# EAGLE design CAN_ISO_Sensor_unit (EAGLE 9.6.2)
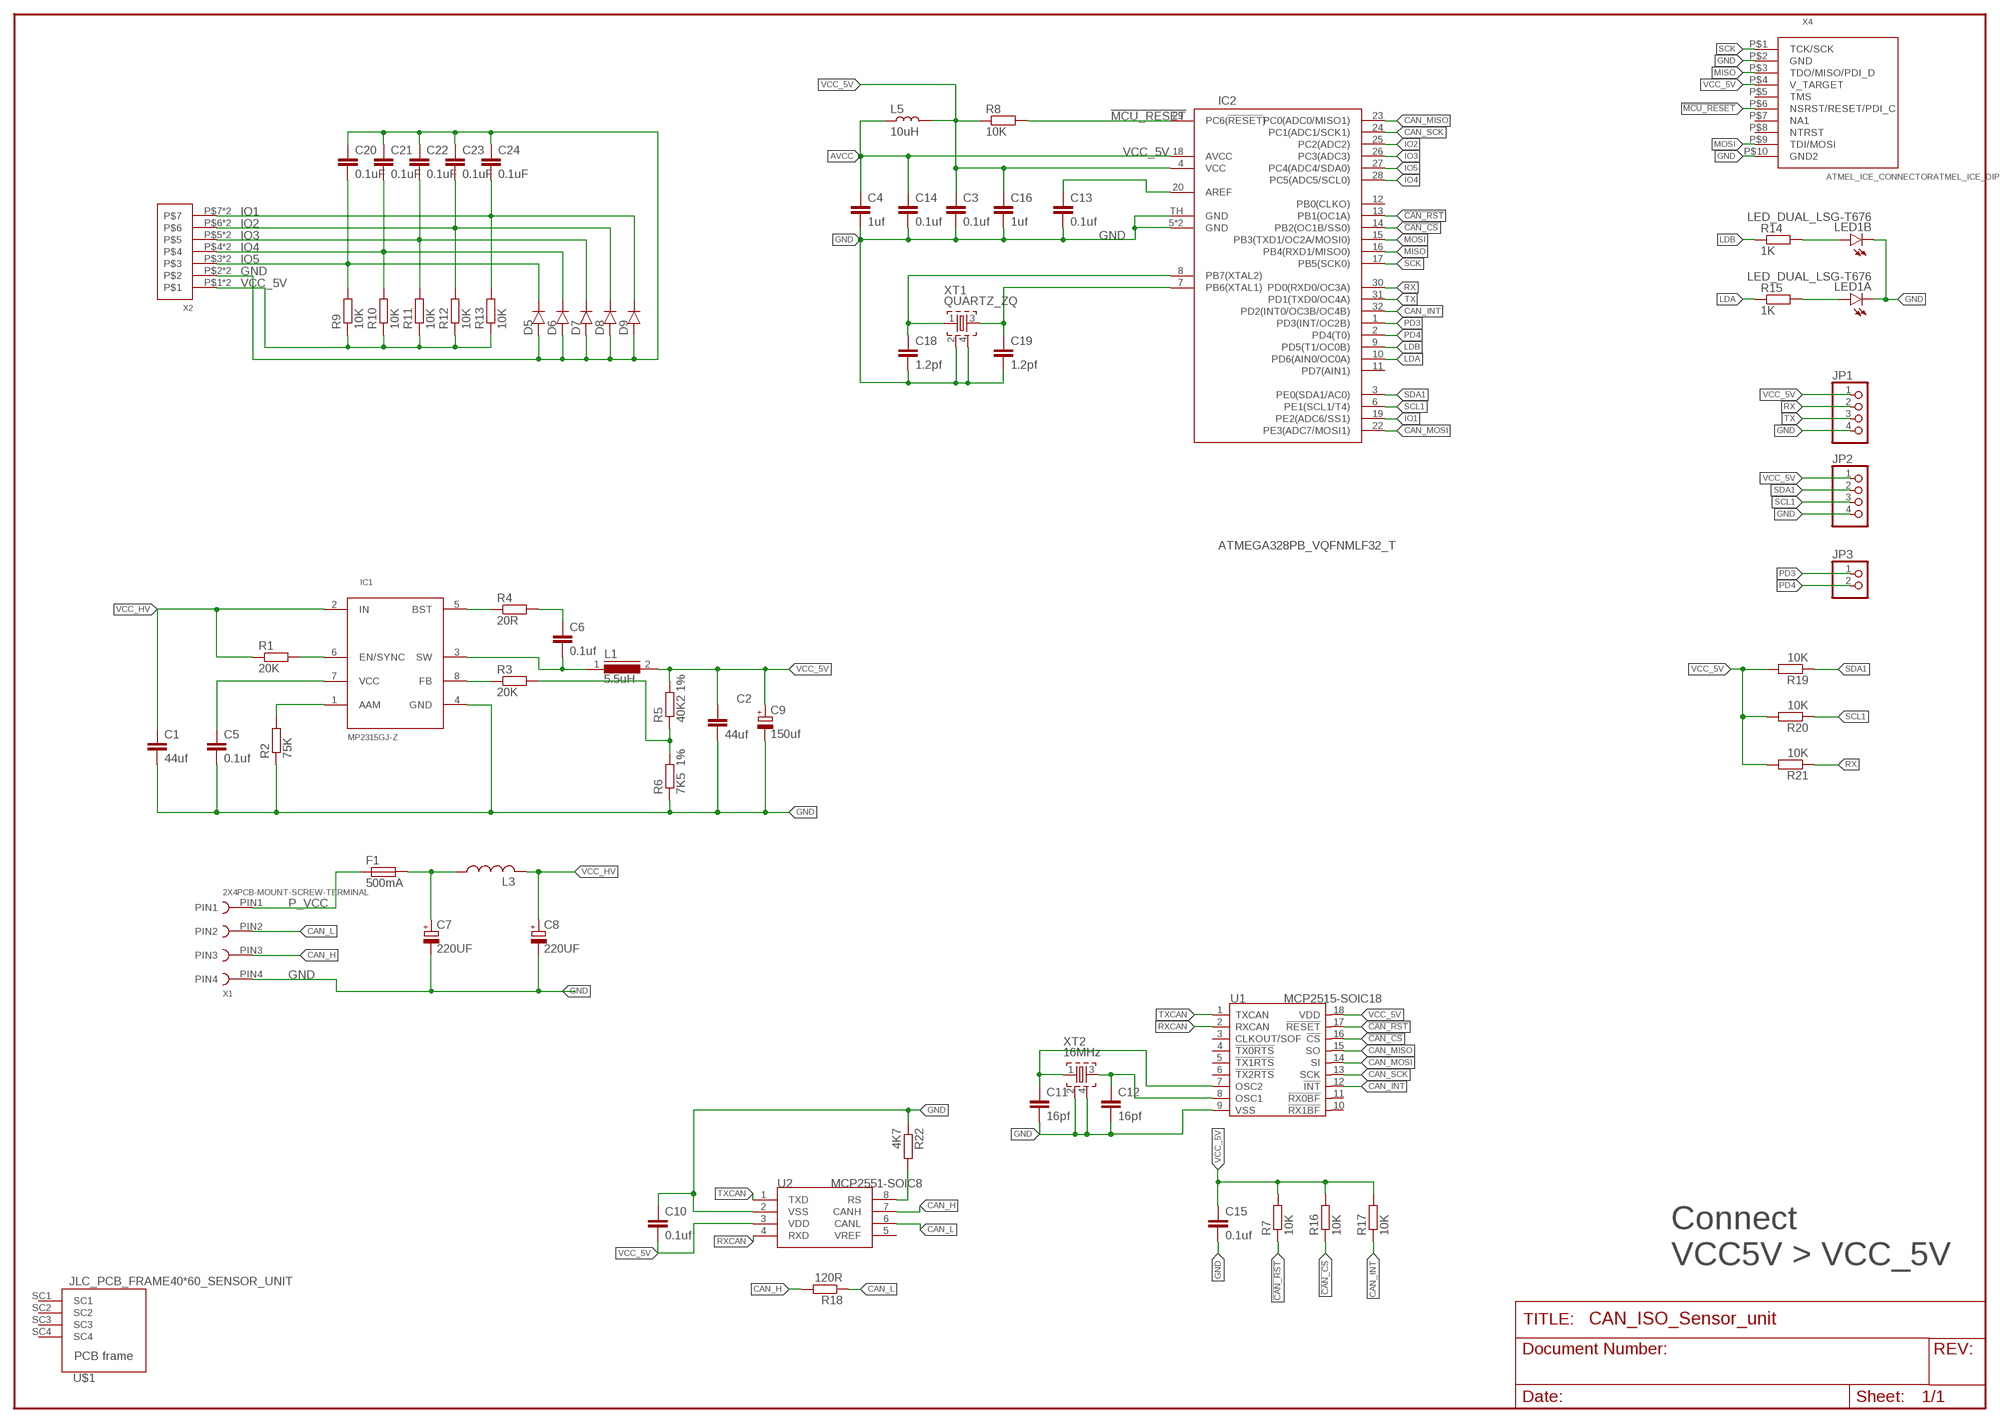
[diagram p0: schematic, sheet 1]

## Parts
C1  44uf  SMD_C3528  [3528_NP]
C2  44uf  SMD_C3528  [3528_NP]
C3  0.1uf  SMD_C0603  [0603]
C4  1uf  SMD_C0603  [0603]
C5  0.1uf  SMD_C0603  [0603]
C6  0.1uf  SMD_C0603  [0603]
C7  220UF  RADIAL_330UF_25V_8MM  [3.6MM]
C8  220UF  RADIAL_330UF_25V_8MM  [3.6MM]
C9  150uf  TANTAL_686_7343  [D/7343-31R]
C10  0.1uf  SMD_C0603  [0603]
C11  16pf  SMD_C0603  [0603]
C12  16pf  SMD_C0603  [0603]
C13  0.1uf  SMD_C0603  [0603]
C14  0.1uf  SMD_C0603  [0603]
C15  0.1uf  SMD_C0603  [0603]
C16  1uf  SMD_C0603  [0603]
C18  1.2pf  SMD_C0603  [0603]
C19  1.2pf  SMD_C0603  [0603]
C20  0.1uF  SMD_C0603  [0603]
C21  0.1uF  SMD_C0603  [0603]
C22  0.1uF  SMD_C0603  [0603]
C23  0.1uF  SMD_C0603  [0603]
C24  0.1uF  SMD_C0603  [0603]
D5  L1N4148WT1GSOD123_GALILE0_SMALL  [SOD-123_MINI-SMA]
D6  L1N4148WT1GSOD123_GALILE0_SMALL  [SOD-123_MINI-SMA]
D7  L1N4148WT1GSOD123_GALILE0_SMALL  [SOD-123_MINI-SMA]
D8  L1N4148WT1GSOD123_GALILE0_SMALL  [SOD-123_MINI-SMA]
D9  L1N4148WT1GSOD123_GALILE0_SMALL  [SOD-123_MINI-SMA]
F1  500mA  SMD_FUSE  [SMD_2410_FUSE_NOK]
IC1  MP2315GJ-Z  [TSOT23-8]
IC2  ATMEGA328PB_VQFNMLF32_T  [MLF32-TH]
JP1  PINHD-1X4  [1X04]
JP2  PINHD-1X4  [1X04]
JP3  PINHD-1X2  [1X02]
L1  5.5uH  DR73  [DR73]
L3  L-US0207/2V  [0207/2V]
L5  10uH  SMD_L  [0805]
LED1  LED_DUAL_LSG-T676  [P-LCC4-0]
R1  20K  SMD_R0603  [0603]
R2  75K  SMD_R0603  [0603]
R3  20K  SMD_R0603  [0603]
R4  20R  SMD_R0603  [0603]
R5  40K2 1%  SMD_R0603  [0603]
R6  7K5 1%  SMD_R0603  [0603]
R7  10K  SMD_R0603  [0603]
R8  10K  SMD_R0603  [0603]
R9  10K  SMD_R0603  [0603]
R10  10K  SMD_R0603  [0603]
R11  10K  SMD_R0603  [0603]
R12  10K  SMD_R0603  [0603]
R13  10K  SMD_R0603  [0603]
R14  1K  SMD_R0603  [0603]
R15  1K  SMD_R0603  [0603]
R16  10K  SMD_R0603  [0603]
R17  10K  SMD_R0603  [0603]
R18  120R  SMD_R0603  [0603]
R19  10K  SMD_R0603  [0603]
R20  10K  SMD_R0603  [0603]
R21  10K  SMD_R0603  [0603]
R22  4K7  SMD_R0603  [0603]
U1  MCP2515-SOIC18  [SO18L]
U2  MCP2551-SOIC8  [SO8]
U$1  JLC_PCB_FRAME40*60_SENSOR_UNIT  [40X60_SENSOR_UNIT]
X1  2X4PCB-MOUNT-SCREW-TERMINAL  [2X4PCB-MOUNT-SCREW-TERMINAL]
X2  WAGO250_X7  [WAGO250_FP_7X]
X4  ATMEL_ICE_CONNECTORATMEL_ICE_DIP_V  [MINI10P_SPI/JTAG/PDI_DIP_V]
XT1  QUARTZ_ZQ  [QUARTZ_3X3MM]
XT2  16MHz  QUARTZ_ZQ  [QUARTZ_3X3MM]

## Nets
!CAN_CS: IC2.14(PB2(OC1B/SS0)) R16.1 U1.16(!CS)
!CAN_RST: IC2.13(PB1(OC1A)) R7.1 U1.17(!RESET)
!MCU_RESET: IC2.29(PC6(!RESET!)) R8.2 X4.P$6(NSRST/RESET/PDI_C)
AREF: C13.1 IC2.20(AREF)
AVCC: C4.1 C14.1 IC2.18(AVCC) L5.1
CAN_H: R18.2 U2.7(CANH) X1.PIN3
CAN_INT: IC2.32(PD2(INT0/OC3B/OC4B)) R17.1 U1.12(!INT)
CAN_L: R18.1 U2.6(CANL) X1.PIN2
CAN_MISO: IC2.23(PC0(ADC0/MISO1)) U1.15(SO)
CAN_MOSI: IC2.22(PE3(ADC7/MOSI1)) U1.14(SI)
CAN_SCK: IC2.24(PC1(ADC1/SCK1)) U1.13(SCK)
FB: R3.2 R5.1 R6.2
GND: C1.P C2.P C3.2 C4.2 C5.2 C7.P$1(-) C8.P$1(-) C9.- C10.1 C11.2 C12.2 C13.2 C14.2 C15.2 C16.2 C18.2 C19.2 C20.1 C21.1 C22.1 C23.1 C24.1 D5.A D6.A D7.A D8.A D9.A IC1.4(GND) IC2.5(GND) IC2.21(GND) IC2.TH(GND) JP1.4 JP2.4 LED1.1(A:C) LED1.3(B:C) R2.1 R6.1 R22.1 U1.9(VSS) U2.2(VSS) X1.PIN4 X2.P$2 X2.U$2 X4.P$2(GND) X4.P$10(GND2) XT1.2 XT1.4 XT2.2 XT2.4
IO1: C24.2 D9.C IC2.19(PE2(ADC6/SS1)) R13.2 X2.P$7 X2.U$7
IO2: C23.2 D8.C IC2.25(PC2(ADC2)) R12.2 X2.P$6 X2.U$6
IO3: C22.2 D7.C IC2.26(PC3(ADC3)) R11.2 X2.P$5 X2.U$5
IO4: C21.2 D6.C IC2.28(PC5(ADC5/SCL0)) R10.2 X2.P$4 X2.U$4
IO5: C20.2 D5.C IC2.27(PC4(ADC4/SDA0)) R9.2 X2.P$3 X2.U$3
LDA: IC2.10(PD6(AIN0/OC0A)) R15.1
LDB: IC2.9(PD5(T1/OC0B)) R14.1
MISO: IC2.16(PB4(RXD1/MISO0)) X4.P$3(TDO/MISO/PDI_D)
MOSI: IC2.15(PB3(TXD1/OC2A/MOSI0)) X4.P$9(TDI/MOSI)
N$1: C7.P$2(+) F1.P$2 L3.1
N$2: IC1.1(AAM) R2.2
N$3: LED1.4(B:A) R14.2
N$4: LED1.2(A:A) R15.2
N$5: C5.1 IC1.7(VCC)
N$6: IC1.6(EN/SYNC) R1.2
N$7: C12.1 U1.8(OSC1) XT2.3
N$8: C11.1 U1.7(OSC2) XT2.1
N$9: IC1.5(BST) R4.1
N$10: C6.1 R4.2
N$11: C6.2 IC1.3(SW) L1.1
N$12: IC1.8(FB) R3.1
N$13: R22.2 U2.8(RS)
N$18: C18.1 IC2.8(PB7(XTAL2)) XT1.1
N$19: C19.1 IC2.7(PB6(XTAL1)) XT1.3
P_VCC: F1.P$1 X1.PIN1
PD3: IC2.1(PD3(INT/OC2B)) JP3.1
PD4: IC2.2(PD4(T0)) JP3.2
RX: IC2.30(PD0(RXD0/OC3A)) JP1.2 R21.1
RXCAN: U1.2(RXCAN) U2.4(RXD)
SCK: IC2.17(PB5(SCK0)) X4.P$1(TCK/SCK)
SCL1: IC2.6(PE1(SCL1/T4)) JP2.3 R20.1
SDA1: IC2.3(PE0(SDA1/AC0)) JP2.2 R19.1
TX: IC2.31(PD1(TXD0/OC4A)) JP1.3
TXCAN: U1.1(TXCAN) U2.1(TXD)
VCC_5V: C2.M C3.1 C9.+ C10.2 C15.1 C16.1 IC2.4(VCC) JP1.1 JP2.1 L1.2 L5.2 R5.2 R7.2 R8.1 R9.1 R10.1 R11.1 R12.1 R13.1 R16.2 R17.2 R19.2 R20.2 R21.2 U1.18(VDD) U2.3(VDD) X2.P$1 X2.U$1 X4.P$4(V_TARGET)
VCC_HV: C1.M C8.P$2(+) IC1.2(IN) L3.2 R1.1
Unconnected: IC2.11(PD7(AIN1)) IC2.12(PB0(CLKO)) U1.3(CLKOUT/SOF) U1.4(!TX0RTS) U1.5(!TX1RTS) U1.6(!TX2RTS) U1.10(!RX1BF) U1.11(!RX0BF) U2.5(VREF) U$1.SC1 U$1.SC2 U$1.SC3 U$1.SC4 X4.P$5(TMS) X4.P$7(NA1) X4.P$8(NTRST)

## Notes on the sheet
- Connect 
  VCC5V > VCC_5V

## Library data of the parts
C1-C6 C10-C16 C18-C24 = passive_components:SMD_C
C7 C8 = passive_components:RADIAL_330UF_25V_8MM
C9 = passive_components:TANTAL_686_7343
D5-D9 = passive_components:L1N4148WT1G
F1 = passive_components:SMD_FUSE
IC1 = my_IC:MP2315GJ-Z
IC2 = my_IC:ATMEGA328PB_VQFN
JP1 JP2 = pinhead:PINHD-1X4: PIN HEADER
JP3 = pinhead:PINHD-1X2: PIN HEADER
L1 = inductors:DR73: High Power Density, High Efficiency, Shielded Inductors Source: coiltronics_dr_series.pdf
L3 = rcl:L-US: INDUCTOR, American symbol
L5 = passive_components:SMD_L
LED1 = passive_components:LED_DUAL_LSG-T676: LSG T676 Hyper Multi TOPLED ® Hyper-Bright LED Source: http://docs-europe.electrocomponents.com/webdocs/08c3/0900766b808c36ca.pdf
R1-R22 = passive_components:SMD_R
U1 = my_IC:MCP2515: Stand-Alone CAN Controller With SPI Interface
U2 = my_IC:MCP2551: High-Speed CAN Transceiver http://ww1.microchip.com/downloads/en/devicedoc/21667f.pdf
U$1 = passive_components:JLC_PCB_FRAME
X1 = Wago_250:2X4PCB-MOUNT-SCREW-TERMINAL
X2 = Wago_250:WAGO250_X7
X4 = passive_components:ATMEL_ICE_CONNECTOR
XT1 XT2 = passive_components:QUARTZ_ZQ

## Board
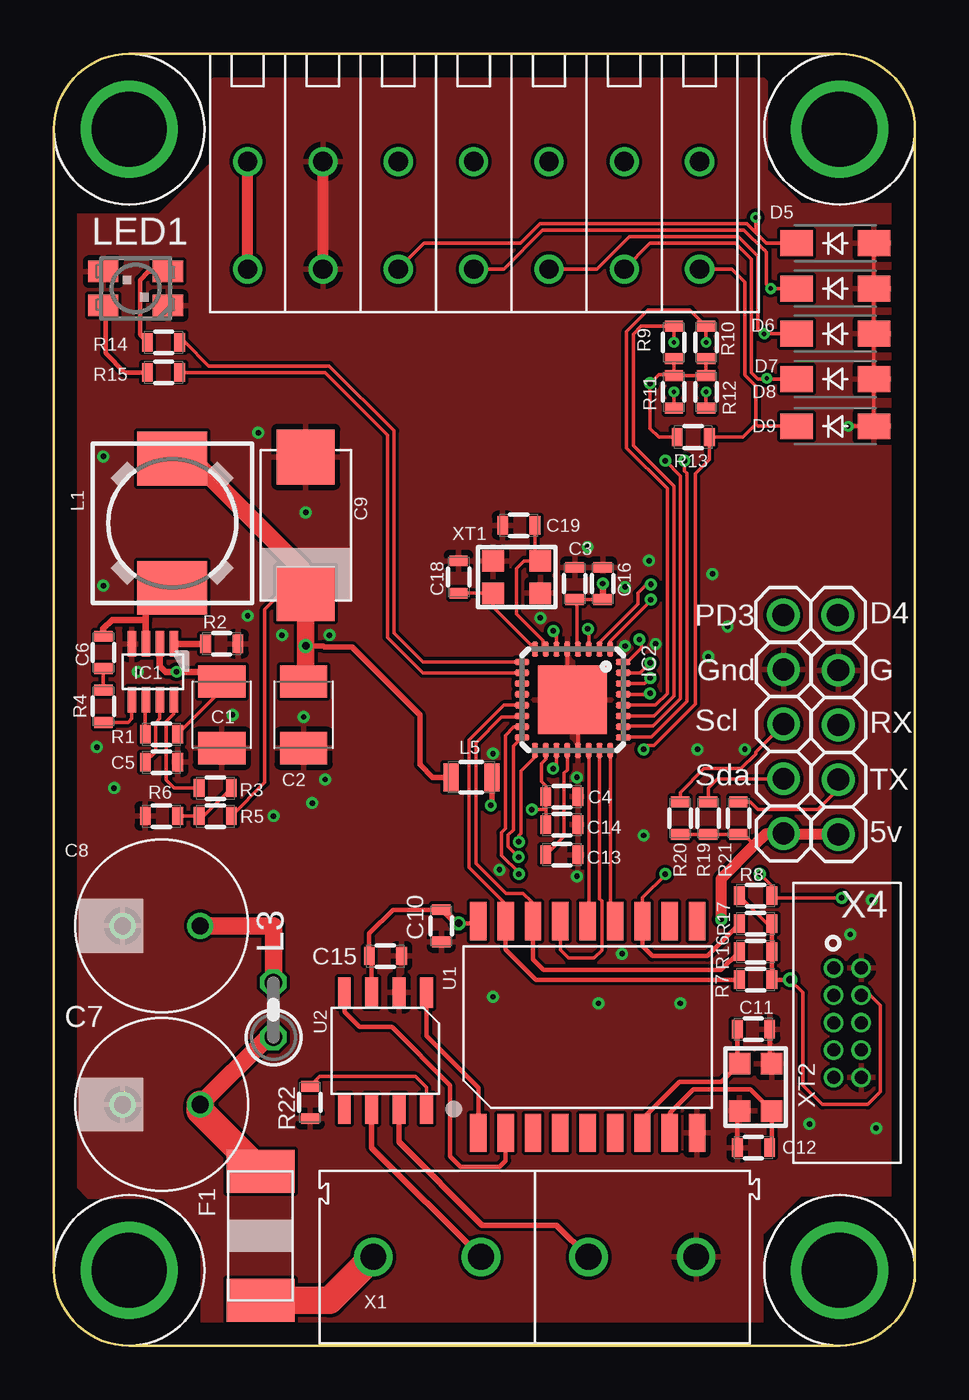
[diagram p1: board, top side]
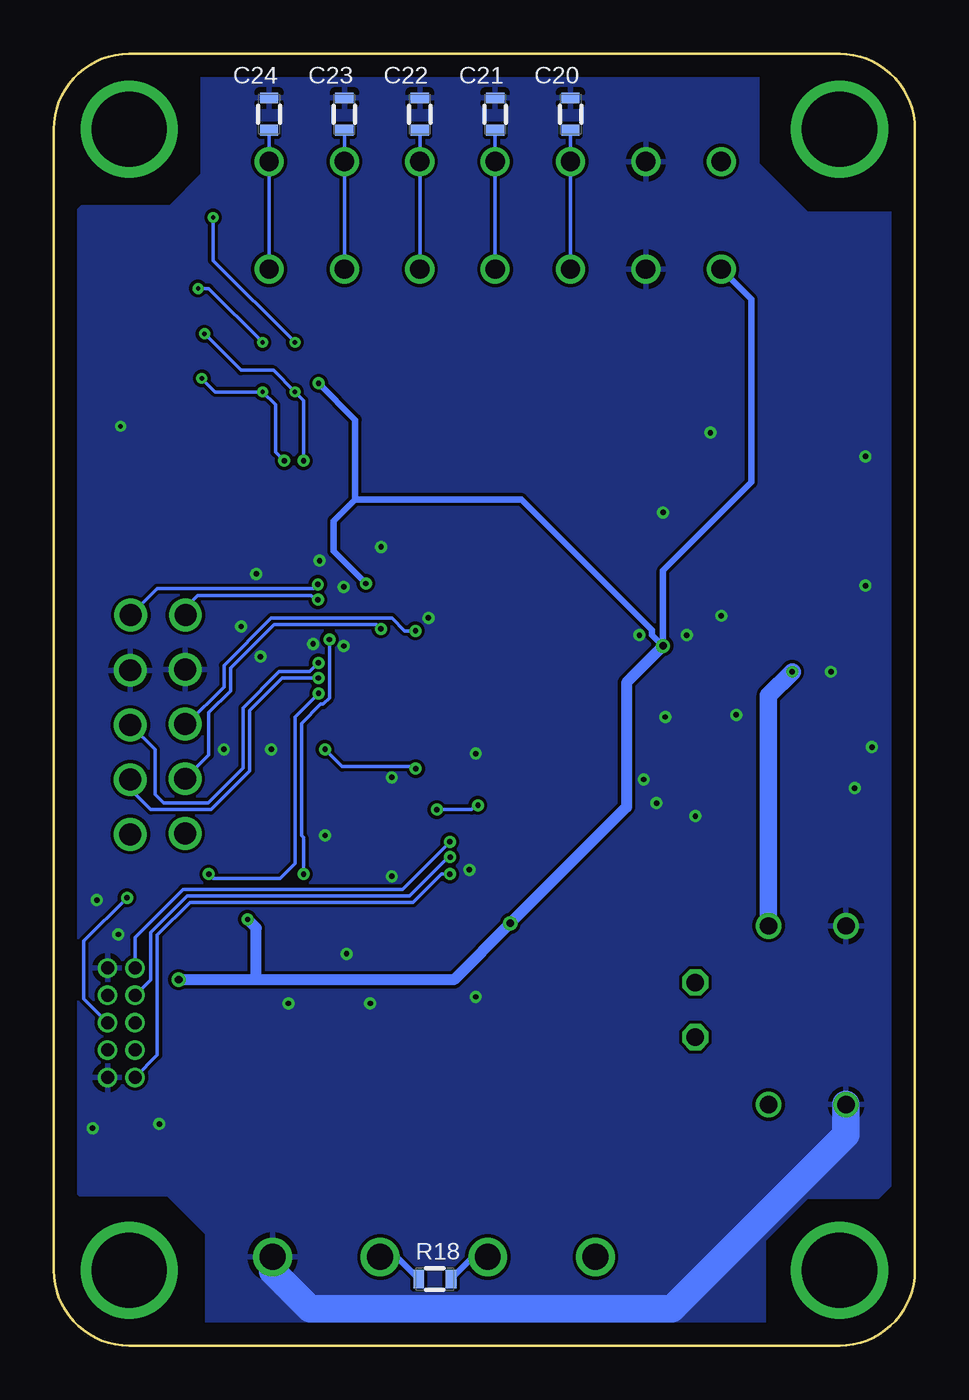
[diagram p2: board, bottom side, seen from below]

Size 40 x 60 mm. Coordinates in mm from the lower left corner, seen from the top.
Copper layers (1*16): Top 0.035mm / dielectric 1.5mm / Bottom 0.035mm
Design rules "default *": minimum track width 6mil, minimum drill 0.2mm, track to track 6mil, track to pad 6mil, pad to pad 6mil, via to via 6mil, smd to smd 6mil, copper to edge 40mil, drill to drill 6mil, minimum pad ring 6mil, minimum via ring 6mil, stop-mask expansion 4mil, vias tented up to drill 20mil, thermal gap 10mil

### Footprints (pad centres in the part's own frame; a part is rotated, then mirrored left to right if it is on the bottom)
3528_NP = smd 1.5 x 2.2: M -1.55,0; P 1.55,0
0603 = smd 0.85 x 0.5: 1 0,0.75; 2 0,-0.75
3.6MM = drill 0.8: P$1 -1.8,0; P$2 1.8,0
D/7343-31R = smd 2.55 x 2.7: + 3.175,0; - -3.175,0
SOD-123_MINI-SMA = smd 1.5 x 1.2: A 1.8,0; C -1.8,0
SMD_2410_FUSE_NOK = smd 2 x 3.15: P$1 -3,0; P$2 3,0
TSOT23-8 = smd 1.2 x 0.4: 1 -1.3,0.975; 2 -1.3,0.325; 3 -1.3,-0.325; 4 -1.3,-0.975; 5 1.3,-0.975; 6 1.3,-0.325; 7 1.3,0.325; 8 1.3,0.975
MLF32-TH = smd 0.7 x 0.3: 1 -2.35,1.75; 2 -2.35,1.25; 3 -2.35,0.75; 4 -2.35,0.25; 5 -2.35,-0.25; 6 -2.35,-0.75; 7 -2.35,-1.25; 8 -2.35,-1.75; 17 2.35,-1.75; 18 2.35,-1.25; 19 2.35,-0.75; 20 2.35,-0.25; 21 2.35,0.25; 22 2.35,0.75; 23 2.35,1.25; 24 2.35,1.75 | smd 0.3 x 0.7: 9 -1.75,-2.35; 10 -1.25,-2.35; 11 -0.75,-2.35; 12 -0.25,-2.35; 13 0.25,-2.35; 14 0.75,-2.35; 15 1.25,-2.35; 16 1.75,-2.35; 25 1.75,2.35; 26 1.25,2.35; 27 0.75,2.35; 28 0.25,2.35; 29 -0.25,2.35; 30 -0.75,2.35; 31 -1.25,2.35; 32 -1.75,2.35 | smd 3.2 x 3.2: TH 0,0
1X04 = drill 1.016: 1 -3.81,0; 2 -1.27,0; 3 1.27,0; 4 3.81,0
1X02 = drill 1.016: 1 -1.27,0; 2 1.27,0
DR73 = smd 2.5 x 3.25: 1 -3,0; 2 3,0
0207/2V = drill 0.813 octagon: 1 -1.27,0; 2 1.27,0
0805 = smd 1.3 x 0.7: 1 0,0.95; 2 0,-0.95
P-LCC4-0 = smd 1 x 1.4: 1 -0.787,-1.5; 2 -0.787,1.5; 3 0.787,1.5; 4 0.787,-1.5
SO18L = smd 0.762 x 1.778: 1 -5.08,-4.915; 2 -3.81,-4.915; 3 -2.54,-4.915; 4 -1.27,-4.915; 5 0,-4.915; 6 1.27,-4.915; 7 2.54,-4.915; 8 3.81,-4.915; 9 5.08,-4.915; 10 5.08,4.915; 11 3.81,4.915; 12 2.54,4.915; 13 1.27,4.915; 14 0,4.915; 15 -1.27,4.915; 16 -2.54,4.915; 17 -3.81,4.915; 18 -5.08,4.915
SO8 = smd 0.6 x 1.4: 1 -1.905,-2.7; 2 -0.635,-2.7; 3 0.635,-2.7; 4 1.905,-2.7; 5 1.905,2.7; 6 0.635,2.7; 7 -0.635,2.7; 8 -1.905,2.7
40X60_SENSOR_UNIT = drill 3.5: SC1 3.5,56.5; SC2 36.5,56.5; SC3 3.5,3.5; SC4 36.5,3.5
2X4PCB-MOUNT-SCREW-TERMINAL = drill 1.2: PIN1 0,2.5; PIN2 0,-2.5; PIN3 0,-7.5; PIN4 0,-12.5
WAGO250_FP_7X = drill 0.9: P$1 0,5; P$2 3.5,5; P$3 7,5; P$4 10.5,5; P$5 14,5; P$6 17.5,5; P$7 21,5; U$1 0,0; U$2 3.5,0; U$3 7,0; U$4 10.5,0; U$5 14,0; U$6 17.5,0; U$7 21,0
MINI10P_SPI/JTAG/PDI_DIP_V = drill 0.6: P$1 -2.54,-1.27; P$2 -2.54,0; P$3 -1.27,-1.27; P$4 -1.27,0; P$5 0,-1.27; P$6 0,0; P$7 1.27,-1.27; P$8 1.27,0; P$9 2.54,-1.27; P$10 2.54,0
QUARTZ_3X3MM = smd 1 x 1: 1 -0.75,1.1; 2 0.75,1.1; 3 0.75,-1.1; 4 -0.75,-1.1

### Placement (x,y rotation side)
C1  7.8,29.3 270 top
C2  11.6,29.3 270 top
C3  24.2,35.4 180 top
C4  23.6,25.5 90 top
C5  5,27.1 90 top
C6  2.3,32.2 180 top
C7  5,11.2 0 top
C8  5,19.5 0 top
C9  11.7,38.1 270 top
C10  18,19.5 180 top
C11  32.5,14.7 90 top
C12  32.5,9.2 270 top
C13  23.6,22.8 90 top
C14  23.6,24.2 90 top
C15  15.4,18.1 90 top
C16  25.5,35.4 180 top
C18  18.8,35.7 180 top
C19  21.6,38.1 270 top
C20  16,57.2 0 bottom
C21  19.5,57.2 0 bottom
C22  23,57.2 0 bottom
C23  26.5,57.2 0 bottom
C24  30,57.2 0 bottom
D5  36.3,51.2 0 top
D6  36.3,49.1 0 top
D7  36.3,47 0 top
D8  36.3,44.9 0 top
D9  36.3,42.7 0 top
F1  9.6,5.1 90 top
IC1  4.6,31.3 270 top
IC2  24.1,30 270 top
JP1  36.45,27.56 90 top
JP2  33.9,27.6 90 top
JP3  35.15,33.93 0 top
L1  5.5,38.2 90 top
L3  10.2,15.6 90 top
L5  19.4,26.4 270 top
LED1  3.8,49.1 90 top
R1  5,28.4 270 top
R2  7.8,32.6 270 top
R3  7.5,25.9 90 top
R4  2.3,29.7 180 top
R5  7.5,24.6 90 top
R6  5,24.6 90 top
R7  32.6,17 90 top
R8  32.6,20.9 90 top
R9  28.8,46.6 180 top
R10  30.3,46.6 180 top
R11  28.8,44.3 0 top
R12  30.3,44.3 0 top
R13  29.7,42.2 90 top
R14  5.1,46.6 270 top
R15  5.1,45.2 270 top
R16  32.6,18.3 90 top
R17  32.6,19.6 90 top
R18  22.3,3.1 270 bottom
R19  30.4,24.5 0 top
R20  29.1,24.5 0 top
R21  31.8,24.5 0 top
R22  11.9,11.3 180 top
U1  24.8,14.8 0 top
U2  15.4,13.7 180 top
U$1  0,0 0 top
X1  17.34,4.12 90 top
X2  9,50 0 top
X4  37.5,15 270 top
XT1  21.5,35.7 90 top
XT2  32.6,12 0 top

### Tracks (layer width: path | path; a pad name or v marks a point on that pad's centre or on a via)
!CAN_CS
  Top 0.152: U1.16 22.2,19.77 22.2,20.6 21.8,21 21,21 19.6,22.4 19.6,28 20.8,29.2 21.7,29.2 IC2.14
  Top 0.2: R16.1 31,17.45 22.75,17.45 22.26,17.94 U1.16
!CAN_RST
  Top 0.152: U1.17 20.99,20.51 19.3,22.2 19.3,28.13 20.92,29.75 IC2.13
  Top 0.2: R7.1 22.4,17 20.99,18.41 U1.17
!MCU_RESET  (via drill 0.25 pad 0.55)
  Top 0.152: v36.6,20.8 33.45,20.8 R8.2 33.35,21.35 v32.8,21.9 | v27.7,30.3 27.65,30.25 IC2.29
  Bottom 0.152: X4.P$6 38.6,16.1 38.6,18.8 v36.6,20.8 | v32.8,21.9 32.6,21.7 29.5,21.7 28.8,22.4 28.8,29.2 v27.7,30.3
AREF
  Top 0.152: IC2.20 23.85,26.75 23.7,26.6 23.7,23.65 C13.1
AVCC  (via drill 0.25 pad 0.55)
  Top 0.152: IC2.18 22.85,27.25 22.65,27.05 22.65,26.2 22.85,26 C4.1 22.85,24.9 | 22.85,24.9 C14.1 | v22.2,24.9 22.85,24.9
  Top 0.254: v20.3,25.1 20.35,25.15 L5.1
  Bottom 0.152: v20.3,25.1 20.4,25.1 20.6,24.9 v22.2,24.9
CAN_H
  Top 0.254: X1.PIN3 23.36,5.6 19.9,5.6 16.04,9.46 U2.7
  Bottom 0.254: R18.2 24.07,4.12 X1.PIN3
CAN_INT  (via drill 0.25 pad 0.55)
  Top 0.152: IC2.32 26.65,31.75 27.3,32.4 27.3,32.7 v27.2,32.8 | v28.4,21.9 28.4,21.88 27.34,20.82 U1.12
  Top 0.2: R17.1 30.35,18.1 27.8,18.1 27.34,18.56 U1.12
  Bottom 0.152: v27.2,32.8 27.2,30.52 27.19,30.51 27.19,30.09 27.49,29.79 27.61,29.79 28.5,28.91 28.5,23.7 28.4,23.6 v28.4,21.9
CAN_L
  Top 0.254: X1.PIN2 14.77,9.2 U2.6
  Bottom 0.254: R18.1 20.53,4.12 X1.PIN2
CAN_MISO
  Top 0.152: IC2.23 25.35,20.76 25.46,20.65 25.46,18.36 25.1,18 23.9,18 23.53,18.37 U1.15
CAN_MOSI
  Top 0.152: IC2.22 24.85,19.77 U1.14
CAN_SCK
  Top 0.152: IC2.24 25.85,19.93 U1.13
FB
  Top 0.152: R3.2 6.95,24.6 R5.1 R6.2
GND  (via drill 0.2 pad 0.35, 0.25)
  Top 0.152: D5.A D6.A D7.A D8.A D9.A v36.9,42.7 | IC2.21 24.35,29.75 24.25,29.85 | 24.25,29.85 IC2.TH | IC2.5 23.85,31.25 24.25,30.85 24.25,29.85
  Top 0.2: C11.2 33.25,13.2 XT2.2 | C12.2 31.75,10.8 XT2.4
  Top 0.508: X2.U$2 X2.P$2
  Bottom 1.27: X1.PIN4 29.84,3.45 28.1,1.71 11.29,1.71 3.2,9.8 C7.P$1
  other vias: 2.3,35.3 3.9,31.3 2,27.8 2.8,25.9 8.3,29.3 11.6,29.2 12.6,26.3 12,25.2 10.2,24.6 10.6,33 9,33.9 12.8,33 11.7,38.7 2.3,41.3 9.5,42.4 24.3,26.4 24.3,21.8 22.6,33.8 24.8,37.1 37,19.1 38,20.7 35.1,10.3 38.2,10.1 20.4,27.5 20.7,22.1 30.4,32 32.1,27.7 31.3,33.4 29.9,27.7 27.4,23.7 26.4,18.2 20.4,16.2 29.1,15.9 25.3,15.9 27.96,32.6 26.54,35.24 26.54,32.5 30.6,35.85 27.65,36.46
  pour Bottom: 0.4,52.6 5,52.6 7.3,54.9 7.3,59.1 8,59.8 32.5,59.8 33.1,59.2 33.1,54.4 34.6,52.9 38.7,52.9 39.8,51.8 39.8,8 38.8,7 34.7,7 32.9,5.2 32.9,0.6 32.3,0 8.1,0 7,1.1 7,4.9 5,6.9 1.7,6.9 0.3,8.3 0.3,52.5
  pour Top: 0.4,52.5 4.9,52.5 7.3,54.9 7.3,58.7 8,59.4 32.4,59.4 33.1,58.7 33.1,54.6 34.6,53.1 34.7,53 38.2,53 39.2,53 39.7,52.5 39.7,7.4 39.3,7 34.8,7 34.7,7 33,5.3 32.9,5.2 32.9,1.7 32.9,1.1 32.1,0.3 31.6,0.3 7.4,0.3 7,0.7 6.9,0.8 6.9,4.1 6.9,5.1 5.1,6.9 1.9,6.9 1.6,6.9 1.1,7.4 1.1,7.5 0.3,8.3 0.3,52.4
IO1  (via drill 0.25 pad 0.55)
  Top 0.152: X2.U$7 31.49,50 32.09,49.4 32.09,45.08 32.6,44.57 32.6,42.8 | 32.6,42.8 32.7,42.7 D9.C | 32.6,42.8 32,42.2 R13.2 30.45,41.15 29.8,40.5 29.8,29.8 27.87,27.87 27.57,27.87 v27.4,27.7 | IC2.19 23.35,26.96 v23.19,26.8
  Bottom 0.152: X2.U$7 X2.P$7 C24.2 | v23.19,26.8 23.3,26.91 24.51,26.91 24.52,26.9 26.6,26.9 v27.4,27.7
IO2  (via drill 0.2 pad 0.35, 0.25 pad 0.55)
  Top 0.152: X2.U$6 27.7,51.2 31.67,51.2 32.4,50.47 32.4,47.07 32.4,45.2 32.7,44.9 33.1,44.9 | 33.1,44.9 D8.C | R12.2 v30.3,44.3 | v33.12,44.92 33.1,44.9 | IC2.25 26.47,28.27 27.77,28.27 29.41,29.92 29.41,40.52 29.3,40.63 v29.3,41.1
  Bottom 0.152: X2.U$6 X2.P$6 C23.2 | v33.12,44.92 32.5,44.3 v30.3,44.3 29.7,43.7 29.7,41.5 v29.3,41.1
IO3  (via drill 0.2 pad 0.35, 0.25 pad 0.55)
  Top 0.152: 22.98,50 X2.U$5 25.22,50 26.73,51.51 31.8,51.51 32.7,50.6 32.7,47.2 32.9,47 v33,47 D7.C | R11.2 v28.8,44.3 | IC2.26 26.47,28.77 27.83,28.77 29.11,30.05 29.11,40.39 v28.4,41.1
  Bottom 0.152: X2.U$5 X2.P$5 C22.2 | v33,47 31.3,45.3 29.8,45.3 v28.8,44.3 28.4,43.9 v28.4,41.1
IO4  (via drill 0.2 pad 0.35)
  Top 0.152: 19,50 X2.U$4 20.9,50 22.71,51.81 32.06,51.81 32.97,50.9 33,50.9 33.1,50.8 33.1,49.3 v33.3,49.1 D6.C | v30.3,46.6 R10.2 29.55,48.1 27.6,48.1 26.6,47.1 26.6,41.7 28.5,39.8 28.5,30.3 27.95,29.75 IC2.28
  Bottom 0.152: X2.U$4 X2.P$4 C21.2 | v30.3,46.6 32.8,49.1 v33.3,49.1
IO5  (via drill 0.2 pad 0.35)
  Top 0.152: X2.U$3 17.2,51.2 21.67,51.2 22.58,52.11 32.19,52.11 32.6,51.7 | D5.C 33.1,51.2 32.6,51.7 | v28.8,46.6 R9.2 27.28,47.35 26.92,46.98 26.92,41.82 28.8,39.93 28.8,30.17 27.88,29.25 IC2.27 | v32.6,52.4 32.6,51.7
  Bottom 0.152: X2.U$3 X2.P$3 C20.2 | v28.8,46.6 32.6,50.4 v32.6,52.4
LDA
  Top 0.152: R15.1 12.6,45.2 15.5,42.3 15.5,32.9 17.15,31.25 IC2.10
LDB
  Top 0.152: R14.1 6.1,46.6 7.2,45.51 12.79,45.51 15.8,42.49 15.8,33.09 17.15,31.75 IC2.9
MISO  (via drill 0.25 pad 0.55)
  Top 0.152: v21.59,22.69 21.09,23.19 21.09,23.71 21.35,23.96 21.35,27.85 IC2.16
  Bottom 0.152: v21.59,22.69 21.68,22.69 23.47,20.89 33.8,20.89 35.5,19.2 35.5,17 X4.P$3
MOSI  (via drill 0.25 pad 0.55)
  Top 0.152: IC2.15 21.73,28.73 21.35,28.73 20.97,28.35 20.97,24.02 20.79,23.84 20.79,22.78 21.6,21.97 v21.6,21.9
  Bottom 0.152: v21.6,21.9 22,21.9 23.31,20.59 33.68,20.59 35.2,19.07 35.2,13.49 X4.P$9
N$1
  Top 0.813: C7.P$2 9.93,14.33 L3.1
  Top 1.27: F1.P$2 6.8,10.9 C7.P$2
N$2
  Top 0.305: IC1.1 R2.2
N$3
  Top 0.2: LED1.4 4.39,49.89 4,49.5 4,46.95 R14.2
N$4
  Top 0.2: LED1.2 2.4,48.21 2.4,46.1 3.3,45.2 R15.2
N$5
  Top 0.152: IC1.7 4.92,29.12 4.73,28.93 4.73,27.58 C5.1
N$6
  Top 0.152: R1.2 4.25,29.98 IC1.6
N$7
  Top 0.2: C12.1 33.35,9.3 XT2.3 32.35,11.9 29.7,11.9 28.61,10.81 U1.8
N$8
  Top 0.2: C11.1 31.75,13.2 XT2.1 31,12.25 29.05,12.25 27.34,10.54 U1.7
N$9
  Top 0.152: R4.1 3.45,28.95 3.62,29.12 IC1.5
N$10
  Top 0.152: C6.1 R4.2
N$11
  Top 0.305: IC1.3 4.28,33.7 | 4.28,33.7 4.28,33.98 L1.1 | C6.2 2.3,33.3 2.7,33.7 4.28,33.7
N$12
  Top 0.152: IC1.8 5.58,29.34 5.22,28.98 5.22,26.28 5.6,25.9 R3.1
N$13
  Top 0.152: U2.8 17.3,11.99 16.8,12.5 12.35,12.5 R22.2
N$18
  Top 0.152: C18.1 XT1.1 20.4,34.3 IC2.8
N$19
  Top 0.152: IC2.7 22.73,32.47 22.73,32.75 21.5,33.98 21.5,36.1 21.85,36.45 XT1.3 22.35,36.7 C19.1
P_VCC
  Top 1.27: X1.PIN1 12.82,2.1 F1.P$1
PD3  (via drill 0.25 pad 0.55)
  Top 0.152: IC2.1 25.85,32.73 27.73,34.61 v27.73,34.65
  Bottom 0.152: v27.73,34.65 27.84,34.65 28.04,34.85 33.33,34.85 33.88,34.29 JP3.1
PD4  (via drill 0.25 pad 0.55)
  Top 0.152: IC2.2 25.35,32.66 27.13,34.44 27.13,34.95 27.53,35.36 v27.74,35.36
  Bottom 0.152: v27.74,35.36 27.94,35.15 35.2,35.15 JP3.2
RX  (via drill 0.25 pad 0.55)
  Top 0.152: IC2.30 27.43,30.75 27.49,30.81 27.5,30.81 v27.71,31.01 | R21.1 32.35,25.25 32.7,24.9 35.5,24.9 36.45,25.85 JP1.2
  Bottom 0.152: v27.71,31.01 v27.71,31 29.4,31 30.9,29.5 30.9,26.7 32.7,24.9 35.5,24.9 36.45,25.85 JP1.2
RXCAN
  Top 0.2: U1.2 20.99,8.59 20.7,8.3 18.9,8.3 18.4,8.8 18.4,12.1 15.7,14.8 14.2,14.8 13.49,15.5 U2.4
SCK  (via drill 0.25 pad 0.55)
  Top 0.152: IC2.17 22.35,27.35 21.7,26.7 21.7,23.8 21.6,23.7 v21.6,23.4
  Bottom 0.152: v21.6,23.4 23.8,21.2 34,21.2 36.23,18.97 X4.P$1
SCL1  (via drill 0.25 pad 0.55)
  Top 0.152: IC2.6 23.35,33.05 v23.2,33.2 | R20.1 29.1,25.7 30.2,26.8 31.92,26.8 32.61,27.49 32.61,27.58 JP2.3
  Bottom 0.152: v23.2,33.2 23.7,33.2 24.3,33.8 29.9,33.8 32.1,31.6 32.1,30.6 33.83,28.87 JP2.3
SDA1  (via drill 0.25 pad 0.55)
  Top 0.152: IC2.3 24.85,33.25 v24.81,33.29 | R19.1 30.4,25.9 30.83,26.33 JP2.2
  Bottom 0.152: v24.81,33.29 25.01,33.49 29.77,33.49 31.8,31.47 31.8,30.41 32.8,29.4 32.8,27.43 JP2.2
TX  (via drill 0.25 pad 0.55)
  Top 0.152: IC2.31 27.23,31.25 27.5,31.51 v27.71,31.71
  Bottom 0.152: v27.71,31.71 27.91,31.51 27.92,31.51 28.12,31.3 29.53,31.3 31.2,29.63 31.2,26.83 32.83,25.2 34.91,25.2 35.3,25.6 35.3,27.68 JP1.3
TXCAN
  Top 0.2: U2.1 17.3,14.39 19.72,11.98 U1.1
VCC_5V  (via drill 0.25 pad 0.55, 0.35)
  Top 0.152: R13.1 28.1,42.2 27.7,42.6 v27.7,44.7 28.1,45.1 28.75,45.1 R11.1 | R11.1 R12.1 R10.1 | R11.1 R9.1 | R5.2 9.8,26.15 9.8,34.2 10.53,34.92 11.5,34.92 C9.+ | X4.P$4 37.93,16.27 38.4,15.8 38.4,11.8 37.8,11.2 35.7,11.2 34.8,12.1 34.8,16.4 v34.2,17 | IC2.4 24.3,32.4 24.3,34.55 C3.1 C16.1 | R8.1 33.15,19.6 R17.2 | R20.2 R19.2 R21.2 32.05,23.75 32.55,23.25
  Top 0.2: U1.18 19.62,19.61 v18.8,19.61 | v18.8,19.61 18.64,19.61 C10.2 | C10.2 15.75,20.25 14.65,19.15 C15.1 14.77,17.98 U2.3 | C10.2 18.16,20.25 v18.8,19.61 | v34.2,17 R7.2 R16.2 R17.2
  Top 0.254: v11.7,32.5 12.51,32.5 12.57,32.44 13.86,32.44 17,29.3 17,27 17.6,26.4 L5.2
  Top 0.305: v25.5,35.4 C16.1
  Top 0.508: X2.U$1 X2.P$1 | v31,19.8 31,21.7 32.55,23.25 33.09,23.79 JP2.1 33.94,23.75 JP1.1
  Top 0.813: L1.2 6.4,41.2 11.5,36.1 11.5,34.92 | C9.+ v11.7,32.5 11.7,30.95 C2.M
  Bottom 0.305: X2.U$1 7.6,48.6 7.6,40.1 11.7,36 v11.7,32.5 12.22,33.02 12.22,33.24 18.28,39.3 26,39.3 | 26,39.3 27,38.3 27,36.9 v25.5,35.4 | 26,39.3 26,43 v27.7,44.7
  Bottom 0.508: v11.7,32.5 13.4,30.8 13.4,25.01 v18.8,19.61 21.41,17 30.6,17 | 30.6,17 v34.2,17 | 30.6,17 30.6,19.4 v31,19.8
VCC_HV  (via drill 0.25 pad 0.55)
  Top 0.152: R1.1 7.8,30.45 C1.M
  Top 0.305: IC1.2 4.92,31.57 5.2,31.3 v5.7,31.3 7.35,31.3 C1.M
  Top 0.813: L3.2 10.2,19.5 C8.P$2
  Bottom 0.813: C8.P$2 6.8,30.2 v5.7,31.3

### Text on the board
tPlace: D4 | PD3 | Gnd | G | Scl | RX | Sda | TX | 5v